# EAGLE schematic transistor-BSS806N (EAGLE 9.5.2)
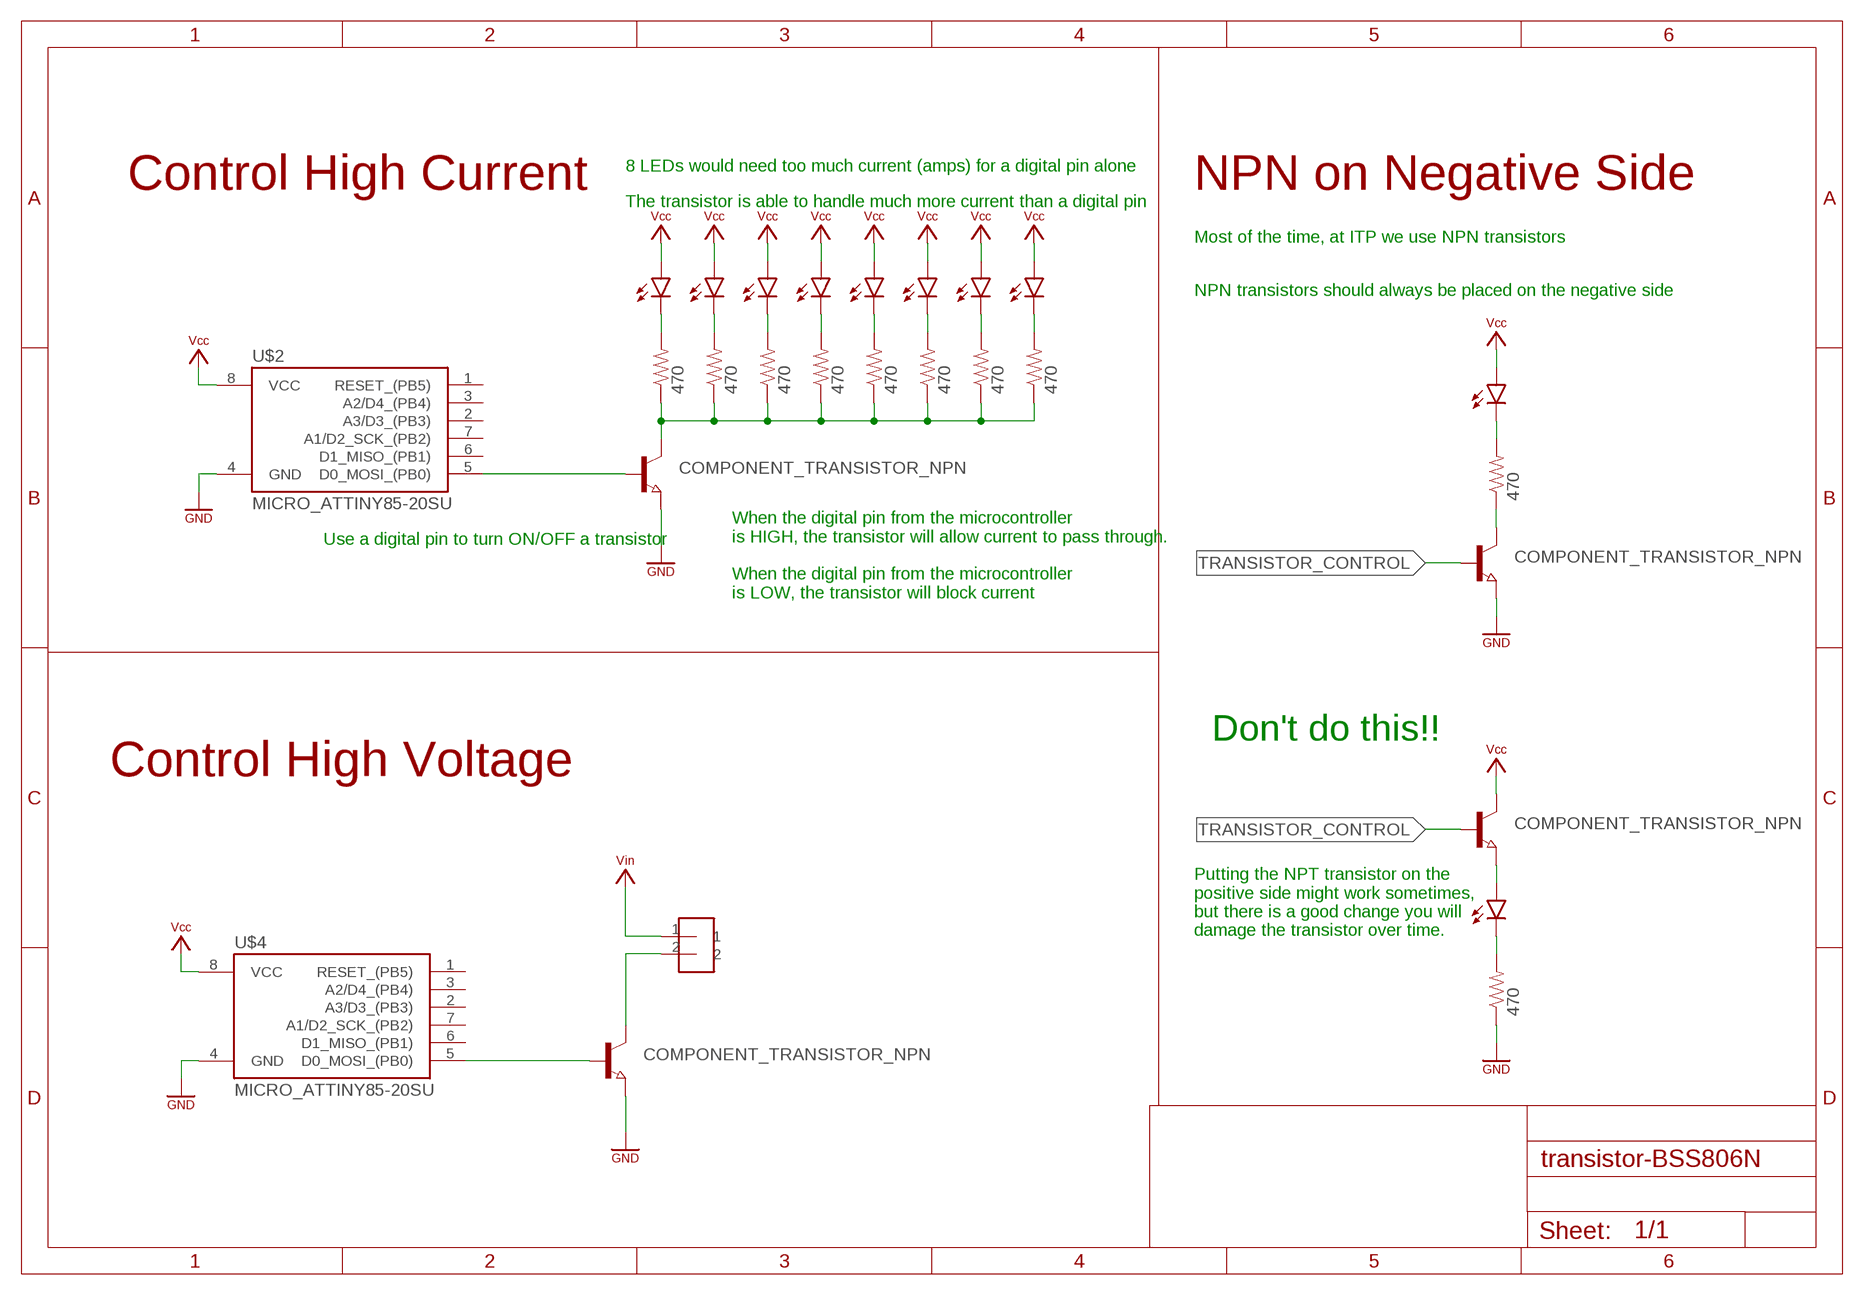
[diagram p0: schematic, sheet 1]

## Parts
LED1  LED-0805  [CHIP-LED0805]
LED2  LED-0805  [CHIP-LED0805]
LED3  LED-0805  [CHIP-LED0805]
LED4  LED-0805  [CHIP-LED0805]
LED5  LED-0805  [CHIP-LED0805]
LED6  LED-0805  [CHIP-LED0805]
LED7  LED-0805  [CHIP-LED0805]
LED8  LED-0805  [CHIP-LED0805]
LED9  LED-0805  [CHIP-LED0805]
LED10  LED-0805  [CHIP-LED0805]
R1  470  COMPONENT_RESISTOR-0805  [0805]
R2  470  COMPONENT_RESISTOR-0805  [0805]
R3  470  COMPONENT_RESISTOR-0805  [0805]
R4  470  COMPONENT_RESISTOR-0805  [0805]
R5  470  COMPONENT_RESISTOR-0805  [0805]
R6  470  COMPONENT_RESISTOR-0805  [0805]
R7  470  COMPONENT_RESISTOR-0805  [0805]
R8  470  COMPONENT_RESISTOR-0805  [0805]
R9  470  COMPONENT_RESISTOR-0805  [0805]
R10  470  COMPONENT_RESISTOR-0805  [0805]
U$1  COMPONENT_TRANSISTOR_NPN  [SOT23]
U$2  MICRO_ATTINY85-20SU  [SOIC8]
U$3  COMPONENT_TRANSISTOR_NPN  [SOT23]
U$4  MICRO_ATTINY85-20SU  [SOIC8]
U$5  CONN_SCREW_TERMINAL  [691508110302]
U$7  COMPONENT_TRANSISTOR_NPN  [SOT23]
U$8  COMPONENT_TRANSISTOR_NPN  [SOT23]

## Nets
GND: R10.1 U$1.2(E) U$2.4(GND) U$3.2(E) U$4.4(GND) U$7.2(E) ; supply symbol labelled SYMBOL_GND
N$1: LED1.C R1.2
N$2: U$1.1(B) U$2.5(D0_MOSI_(PB0))
N$3: LED2.C R2.2
N$4: U$3.3(C) U$5.2
N$5: LED3.C R3.2
N$6: U$3.1(B) U$4.5(D0_MOSI_(PB0))
N$7: LED4.C R4.2
N$8: LED10.A U$8.2(E)
N$9: LED5.C R5.2
N$10: R9.1 U$7.3(C)
N$11: LED6.C R6.2
N$12: LED9.C R9.2
N$13: LED7.C R7.2
N$14: LED10.C R10.2
N$15: LED8.C R8.2
N$16: R1.1 R2.1 R3.1 R4.1 R5.1 R6.1 R7.1 R8.1 U$1.3(C)
TRANSISTOR_CONTROL: U$7.1(B) U$8.1(B)
VCC: LED1.A LED2.A LED3.A LED4.A LED5.A LED6.A LED7.A LED8.A LED9.A U$2.8(VCC) U$4.8(VCC) U$8.3(C) ; supply symbol labelled SYMBOL_VCC
VIN: U$5.1 ; supply symbol labelled SYMBOL_VIN
Unconnected: U$2.1(RESET_(PB5)) U$2.2(A3/D3_(PB3)) U$2.3(A2/D4_(PB4)) U$2.6(D1_MISO_(PB1)) U$2.7(A1/D2_SCK_(PB2)) U$4.1(RESET_(PB5)) U$4.2(A3/D3_(PB3)) U$4.3(A2/D4_(PB4)) U$4.6(D1_MISO_(PB1)) U$4.7(A1/D2_SCK_(PB2))

## Notes on the sheet
- 8 LEDs would need too much current (amps) for a digital pin alone
- Control High Current | NPN on Negative Side
- The transistor is able to handle much more current than a digital pin
- Most of the time, at ITP we use NPN transistors
- NPN transistors should always be placed on the negative side
- Use a digital pin to turn ON/OFF a transistor
- When the digital pin from the microcontroller
  is HIGH, the transistor will allow current to pass through.
  
  When the digital pin from the microcontroller
  is LOW, the transistor will block current
- Don't do this!!
- Control High Voltage
- Putting the NPT transistor on the
  positive side might work sometimes,
  but there is a good change you will
  damage the transistor over time.

## Library data of the parts
LED1-LED10 = homemade-hardware:LED: LEDs Standard schematic elements and footprints for 5mm, 3mm, 1206, and 0603 sized LEDs. 5mm - Spark Fun Electronics SKU : COM-00529 (and others)
R1-R10 = homemade-hardware:COMPONENT_RESISTOR
U$1 U$3 U$7 U$8 = homemade-hardware:COMPONENT_TRANSISTOR_NPN: BSS806NH6327XTSA1 <https://www.digikey.com/product-detail/en/infineon-technologies/BSS806NH6327XTSA1/BSS806NH6327XTSA1DKR-ND/3196843>: NPN Moseft Transistor - 20V 2.3A; PN: BSS806NH6327XTSA1
U$2 U$4 = homemade-hardware:MICRO_ATTINY85
U$5 = homemade-hardware:CONN_SCREW_TERMINAL: 691508110302 <https://www.digikey.com/product-detail/en/wurth-electronics-inc/691508110302/732-5963-6-ND/5047710>: Screw terminal - 3.5mm pitch - 16-30 AWG; HEIGHT: 10.9; PN: 691508110302